# Altium schematic sheet IoT_Greenhouse V1.0 A - Pwr Input.SchDoc
size A4; SheetNumber: 2; SheetTotal: 5
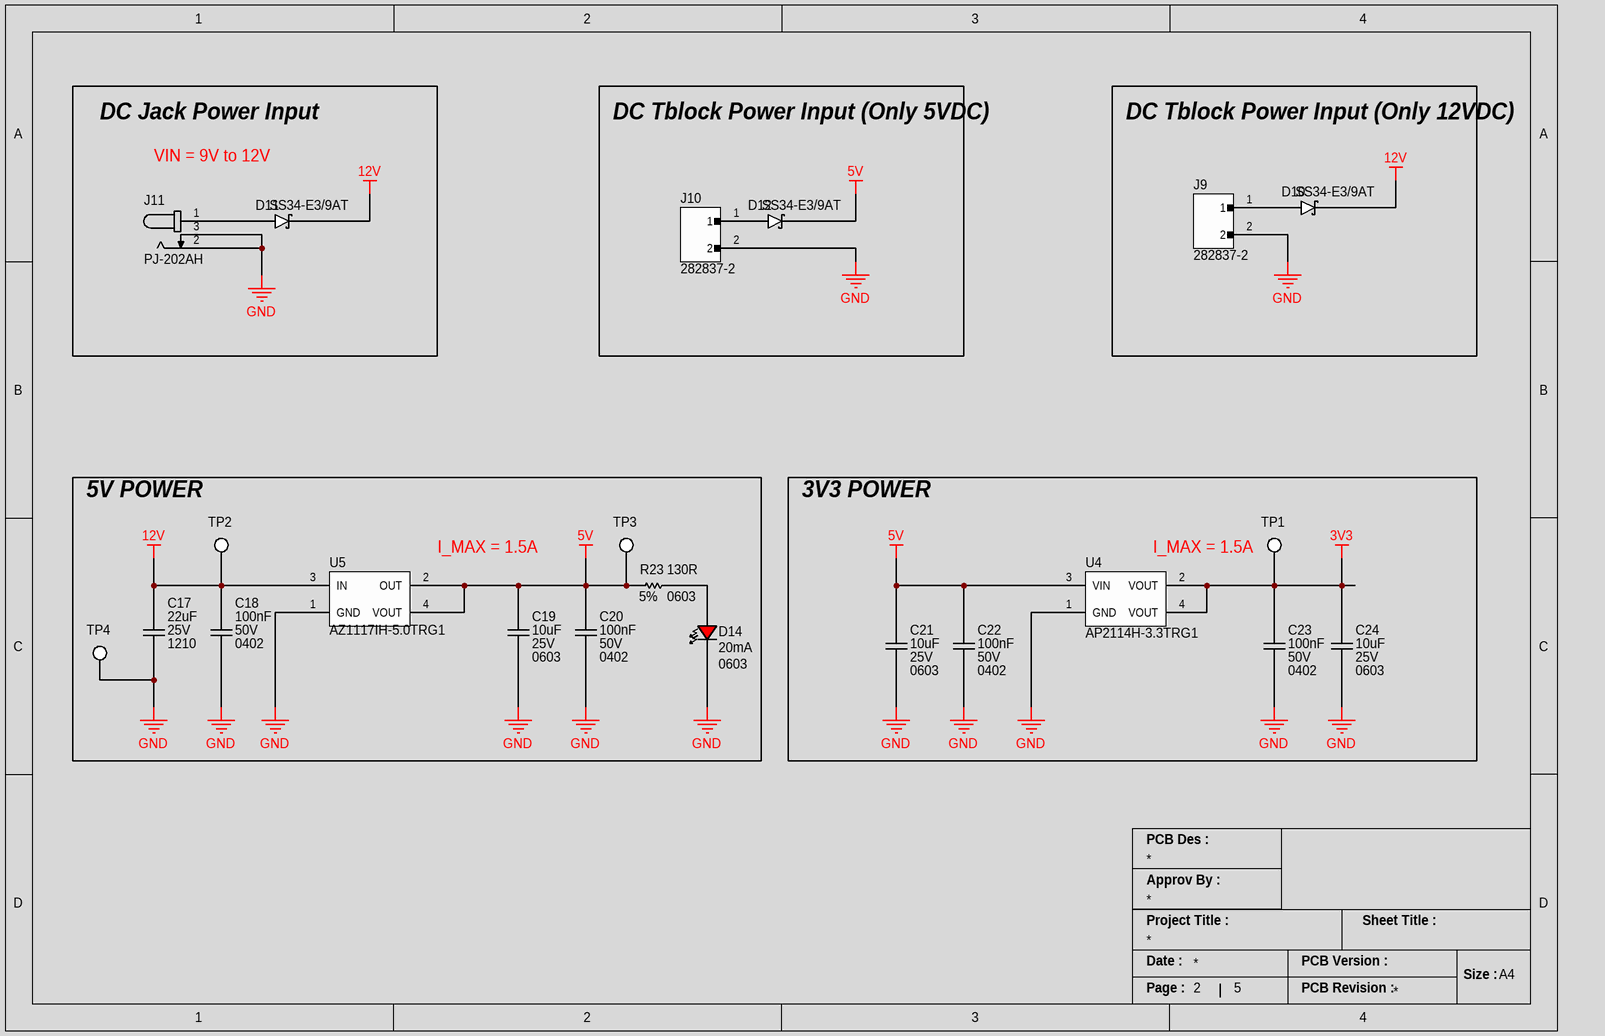
[diagram p0: IoT_Greenhouse V1.0 A - Pwr Input.SchDoc]

## Parts
C17  Voltage Rating: 25V  Capacitance: 22uF  Case/Package: 1210  [CAP_1210_CAPC3225X270N]  (hidden comment: GRM32ER71E226KE15L)
C18  Voltage Rating: 50V  Capacitance: 100nF  Case/Package: 0402  [CAP_0402_CAPC1005X05N]  (hidden comment: GRM155R71H104KE14D)
C19  Case/Package: 0603  Capacitance: 10uF  Voltage Rating: 25V  [CAP_0603_CAPC1608X08N]  (hidden comment: GRM188R61E106MA73D)
C20  Voltage Rating: 50V  Capacitance: 100nF  Case/Package: 0402  [CAP_0402_CAPC1005X05N]  (hidden comment: GRM155R71H104KE14D)
C21  Case/Package: 0603  Capacitance: 10uF  Voltage Rating: 25V  [CAP_0603_CAPC1608X08N]  (hidden comment: GRM188R61E106MA73D)
C22  Voltage Rating: 50V  Capacitance: 100nF  Case/Package: 0402  [CAP_0402_CAPC1005X05N]  (hidden comment: GRM155R71H104KE14D)
C23  Voltage Rating: 50V  Capacitance: 100nF  Case/Package: 0402  [CAP_0402_CAPC1005X05N]  (hidden comment: GRM155R71H104KE14D)
C24  Case/Package: 0603  Capacitance: 10uF  Voltage Rating: 25V  [CAP_0603_CAPC1608X08N]  (hidden comment: GRM188R61E106MA73D)
D10  SS34-E3/9AT  [DIO_Vishay_SMC_MFG]
D11  SS34-E3/9AT  [DIO_Vishay_SMC_MFG]
D12  SS34-E3/9AT  [DIO_Vishay_SMC_MFG]
D14  Test Current: 20mA  Case/Package: 0603  [LED_0603-RED-0.75mm]  (hidden comment: LTST-C190KRKT)
J9  282837-2  [CONN_TBLOCK_2P_\2828372]
J10  282837-2  [CONN_TBLOCK_2P_\2828372]
J11  PJ-202AH  [CONN_CUI_PJ-202AH]
R23  Tolerance: 5%  Resistence: 130R  Case/packcage: 0603  [RES_0603_RESC1608X04N]  (hidden comment: RC0603JR-07130RL)
TP1  NO COMPONENT  [TP_PAD_1.6MM_SMD_ROUND]  (value not drawn)  (no BOM)
TP2  NO COMPONENT  [TP_PAD_1.6MM_SMD_ROUND]  (value not drawn)  (no BOM)
TP3  NO COMPONENT  [TP_PAD_1.6MM_SMD_ROUND]  (value not drawn)  (no BOM)
TP4  NO COMPONENT  [TP_PAD_1.6MM_SMD_ROUND]  (value not drawn)  (no BOM)
U4  AP2114H-3.3TRG1  [IC_REG_SOT230P700X180-4N]
U5  AZ1117IH-5.0TRG1  [IC_REG_SOT230P700X180-4N]

## Blocks framed on the sheet
DC Jack Power Input: D11 J11
DC Tblock Power Input (Only 5VDC): D12 J10
DC Tblock Power Input (Only 12VDC): D10 J9
5V POWER: C17-C20 D14 R23 TP2-TP4 U5
3V3 POWER: C21-C24 TP1 U4

## Nets
3V3: C23.2 C24.2 TP1.1 U4.2(VOUT) U4.4(VOUT)
5V: C19.2 C20.2 C21.2 C22.2 D12.1(K) R23.1 TP3.1 U4.3(VIN) U5.2(OUT) U5.4(VOUT)
12V: C17.2 C18.2 D10.1(K) D11.1(K) TP2.1 U5.3(IN)
GND: C17.1 C18.1 C19.1 C20.1 C21.1 C22.1 C23.1 C24.1 D14.1(C) J9.2 J10.2 J11.2 J11.3 TP4.1 U4.1(GND) U5.1(GND)
NetD10_2: D10.2(A) J9.1
NetD11_2: D11.2(A) J11.1
NetD12_2: D12.2(A) J10.1
NetD14_2: D14.2(A) R23.2

## Notes on the sheet
- VIN = 9V to 12V
- (near U5) I_MAX = 1.5A
- (near TP1) I_MAX = 1.5A
- PCB Des :
- Approv By :
- Project Title :
- Sheet Title :
- Date :
- PCB Version :
- Size :
- A4
- Page :
- PCB Revision :

## Library data of the parts
C17 = CAP_22UF_25V_X7R_1210: Multilayer Ceramic Capacitor, 22 uF, 25 V, ± 10%, X7R, 1210 [3225 Metric]; Manufacturer: Murata; Color: 46Colour; Current Rating: 3A; Gender: 29Gender; Supplier 1: Digikey; Manufacturer Part Number: GRM32ER71E226KE15L; RoHS: Yes; Category: Ceramic Capacitors; Stock 1: 230605; Pricing 1: 1=0.76, 10=0.535, 50=0.4502, 100=0.3666, 500=0.30548 (USD); Mount: Surface Mount; Number of Pins: 2; Case Code (Metric): 3225; Case Code (Imperial): 1210; Material: Ceramic; Contact Material: 150ConductorMaterial; Contact Plating: 157ConductorMaterial; Min Operating Temperature: -55°C; Max Operating Temperature: 125°C; Tolerance: 10%; Dielectric: X7R; Packaging: Tape and Reel; Package Quantity: 1; Voltage Rating (DC): 25V; Termination: SMD/SMT; Voltage: 25V; Series: GRM; Construction: Flat; Length: 3.2mm; Width: 0.098inch; Height: 2.5mm; Thickness: 0.106inch; Depth: 2.5mm; Lead Pitch: 2.54mm; Radiation Hardening: No; Reach SVHC Compliant: No; Lead Free: Lead Free; RoHS Compliant: Yes; ComponentLink1URL: https://datasheet.ciiva.com/6072/1697714-6072768.pdf?src-supplier=Farnell; ComponentLink1Description: https://datasheet.ciiva.com/6072/1697714-6072768.pdf?src-supplier=Farnell; ComponentLink2URL: https://datasheet.ciiva.com/3776/2741grm32er71e226ke1523-3776996.pdf?src-supplier=Arrow+Electronics; ComponentLink2Description: https://datasheet.ciiva.com/3776/2741grm32er71e226ke1523-3776996.pdf?src-supplier=Arrow+Electronics; ComponentLink3URL: https://datasheet.ciiva.com/11789/0900766b80ef921d-11789129.pdf?src-supplier=Rs; ComponentLink3Description: https://datasheet.ciiva.com/11789/0900766b80ef921d-11789129.pdf?src-supplier=Rs; ComponentLink4URL: https://datasheet.ciiva.com/16497/product-16497009.pdf?src-supplier=Future+Electronics; ComponentLink4Description: https://datasheet.ciiva.com/16497/product-16497009.pdf?src-supplier=Future+Electronics; ComponentLink5URL: https://datasheet.ciiva.com/29201/451826-da-01-de-vs-kondens-grm32-er71e-226ke15l-29201795.pdf?src-supplier=Conrad; ComponentLink5Description: https://datasheet.ciiva.com/29201/451826-da-01-de-vs-kondens-grm32-er71e-226ke15l-29201795.pdf?src-supplier=Conrad; ComponentLink6URL: https://datasheet.ciiva.com/175/partnumbering-e-01-175746.pdf?src-supplier=Digikey; ComponentLink6Description: https://datasheet.ciiva.com/175/partnumbering-e-01-175746.pdf?src-supplier=Digikey; ComponentLink7URL: https://datasheet.ciiva.com/175/partnumbering-e-01-175747.pdf?src-supplier=Digikey; ComponentLink7Description: https://datasheet.ciiva.com/175/partnumbering-e-01-175747.pdf?src-supplier=Digikey; ComponentLink8URL: https://datasheet.ciiva.com/175/partnumbering-e-01-175748.pdf?src-supplier=Digikey; ComponentLink8Description: https://datasheet.ciiva.com/175/partnumbering-e-01-175748.pdf?src-supplier=Digikey; ComponentLink9URL: https://datasheet.ciiva.com/22703/1697714-22703397.pdf?src-supplier=Element14; ComponentLink9Description: https://datasheet.ciiva.com/22703/1697714-22703397.pdf?src-supplier=Element14; Supplier Part Number 1: 490-5313-1-ND
C18 C20 C22 C23 = CAP_100NF_50V_X7R_0402: Multilayer Ceramic Capacitor, 0.1 uF, 16 V, ± 10%, X7R, 0402 [1005 Metric]; Manufacturer: Murata; Dissipation Factor: 0.025%; Temperature Coefficient: 30ppm/°C; Supplier 1: DigiKey; Manufacturer Part Number: GRM155R71H104KE14D; RoHS: Yes; Category: Ceramic Capacitors; Stock 1: 13730790; Pricing 1: 1=0.1, 10=0.023, 50=0.0132, 100=0.0102, 500=0.00768, 1000=0.00603, 2500=0.00548, 5000=0.00504 (USD); Mount: Surface Mount; Number of Pins: 2NUMBER; Case Code (Metric): 1005; Material: Ceramic; Case Code (Imperial): 0402; Weight: 0.000212oz; Dielectric Material: Ceramic; Min Operating Temperature: -55°C; Max Operating Temperature: 125°C; Packaging: Tape and Reel; Package Quantity: 10000; Series: GRM; Tolerance: 10%; Dielectric: X7R; Termination: SMD/SMT; Voltage: 50V; Voltage Rating (DC): 50V; Construction: Flat; Length: 1mm; Width: 0.5mm; Height: 0.5mm; Depth: 0.5mm; Thickness: 0.022inch; Reach SVHC Compliant: No; RoHS Compliant: Yes; Lead Free: 5697LeadFree; ComponentLink1URL: http://www.farnell.com/datasheets/2079156.pdf?src-supplier=Farnell; ComponentLink1Description: http://www.farnell.com/datasheets/2079156.pdf?src-supplier=Farnell; ComponentLink2URL: http://www.mouser.com/ds/2/281/c02e-2905.pdf?src-supplier=Mouser; ComponentLink2Description: http://www.mouser.com/ds/2/281/c02e-2905.pdf?src-supplier=Mouser; ComponentLink3URL: http://www.farnell.com/datasheets/2079156.pdf?src-supplier=Newark; ComponentLink3Description: http://www.farnell.com/datasheets/2079156.pdf?src-supplier=Newark; ComponentLink4URL: https://datasheet.octopart.com/GRM155R71H104KE14D-Murata-datasheet-22122223.pdf?src-supplier=Future+Electronics; ComponentLink4Description: https://datasheet.octopart.com/GRM155R71H104KE14D-Murata-datasheet-22122223.pdf?src-supplier=Future+Electronics; ComponentLink5URL: https://search.murata.co.jp/Ceramy/image/img/A01X/G101/ENG/GRM155R71H104KE14-01.pdf?src-supplier=Digi-Key; ComponentLink5Description: https://search.murata.co.jp/Ceramy/image/img/A01X/G101/ENG/GRM155R71H104KE14-01.pdf?src-supplier=Digi-Key; ComponentLink6URL: http://psearch.en.murata.com/capacitor/product/GRM155R71H104KE14%23.pdf?src-supplier=Avnet; ComponentLink6Description: http://psearch.en.murata.com/capacitor/product/GRM155R71H104KE14%23.pdf?src-supplier=Avnet; ComponentLink7URL: https://datasheet.octopart.com/GRM155R71H104KE14D-Murata-datasheet-66077078.pdf?src-supplier=Element14; ComponentLink7Description: https://datasheet.octopart.com/GRM155R71H104KE14D-Murata-datasheet-66077078.pdf?src-supplier=Element14; Supplier Part Number 1: 490-10700-6-ND; Supplier 2: Digikey; Stock 2: 3706055; Pricing 2: 1=0.1, 10=0.037, 50=0.021, 100=0.0162, 500=0.01224, 1000=0.00961, 2500=0.00874, 5000=0.00804 (USD); Halogen Free: 5694HalogenFree; ComponentLink8URL: http://www.mouser.com/ds/2/447/UPY-GPHC_X5R_4V-to-50V_25-1131599.pdf?src-supplier=Mouser; ComponentLink8Description: http://www.mouser.com/ds/2/447/UPY-GPHC_X5R_4V-to-50V_25-1131599.pdf?src-supplier=Mouser; ComponentLink9URL: https://datasheet.octopart.com/CC0402KRX5R8BB104-Yageo-datasheet-137700082.pdf?src-supplier=Future+Electronics; ComponentLink9Description: https://datasheet.octopart.com/CC0402KRX5R8BB104-Yageo-datasheet-137700082.pdf?src-supplier=Future+Electronics; ComponentLink10URL: http://www.yageo.com/documents/recent/UPY-GPHC_X5R_4V-to-50V_25.pdf?src-supplier=Digikey; ComponentLink10Description: http://www.yageo.com/documents/recent/UPY-GPHC_X5R_4V-to-50V_25.pdf?src-supplier=Digikey; ComponentLink11URL: https://datasheet.octopart.com/CC0402KRX5R8BB104-Yageo-datasheet-140260304.pdf?src-supplier=Newark; ComponentLink11Description: https://datasheet.octopart.com/CC0402KRX5R8BB104-Yageo-datasheet-140260304.pdf?src-supplier=Newark; ComponentLink12URL: https://datasheet.octopart.com/CC0402KRX5R8BB104-Yageo-datasheet-170350636.pdf?src-supplier=Future+Electronics; ComponentLink12Description: https://datasheet.octopart.com/CC0402KRX5R8BB104-Yageo-datasheet-170350636.pdf?src-supplier=Future+Electronics; ComponentLink13URL: http://www.yageo.com/documents/recent/UPY-GPHC_X5R_4V-to-50V-16.pdf?src-supplier=Future+Electronics; ComponentLink13Description: http://www.yageo.com/documents/recent/UPY-GPHC_X5R_4V-to-50V-16.pdf?src-supplier=Future+Electronics; Supplier Part Number 2: 311-1697-1-ND
C19 C21 C24 = CAP_10UF_25V_X5R_0603: Multilayer Ceramic Capacitor, 10 uF, 25 V, ± 20%, X5R, 0603 [1608 Metric]; Manufacturer: Murata; Material: 4241ConductorMaterial; Supplier 1: Digi-Key; Manufacturer Part Number: GRM188R61E106MA73D; RoHS: Yes; Category: Ceramic Capacitors; Stock 1: 2712970; Pricing 1: 1=0.26, 10=0.168, 50=0.1176, 100=0.0949, 500=0.07054, 1000=0.06173 (USD); Mount: Surface Mount; Number of Pins: 2; Case Code (Imperial): 0603; Weight: 0.000222oz; Min Operating Temperature: -55°C; Max Operating Temperature: 85°C; Tolerance: 20%; Packaging: Cut Tape; Package Quantity: 1; Dielectric: X5R; Voltage: 25V; Termination: SMD/SMT; Voltage Rating (DC): 25V; Series: GRM; Construction: Flat; Length: 1.6mm; Width: 0.031inch; Height: 0.8mm; Thickness: 0.031inch; Depth: 0.8mm; Reach SVHC Compliant: No; Lead Free: Lead Free; RoHS Compliant: Yes; ComponentLink1URL: https://datasheet.ciiva.com/22776/c02e-22776427.pdf?src-supplier=Farnell; ComponentLink1Description: https://datasheet.ciiva.com/22776/c02e-22776427.pdf?src-supplier=Farnell; ComponentLink2URL: https://datasheet.ciiva.com/22619/c02e-22619674.pdf?src-supplier=Element14; ComponentLink2Description: https://datasheet.ciiva.com/22619/c02e-22619674.pdf?src-supplier=Element14; ComponentLink3URL: https://datasheet.ciiva.com/22776/608985-22776426.pdf?src-supplier=Farnell; ComponentLink3Description: https://datasheet.ciiva.com/22776/608985-22776426.pdf?src-supplier=Farnell; ComponentLink4URL: https://datasheet.ciiva.com/14906/partnumbering-e-01-14906431.pdf?src-supplier=Digi-Key; ComponentLink4Description: https://datasheet.ciiva.com/14906/partnumbering-e-01-14906431.pdf?src-supplier=Digi-Key; ComponentLink5URL: https://datasheet.ciiva.com/14906/partnumbering-e-01-14906429.pdf?src-supplier=Digi-Key; ComponentLink5Description: https://datasheet.ciiva.com/14906/partnumbering-e-01-14906429.pdf?src-supplier=Digi-Key; Supplier Part Number 1: 490-7202-1-ND; Case Code (Metric): 1608
D10-D12 = DIO_SCTKY_40V_3A: Rectifier Diode, schottky, 40V V(Rrm), do-214Ab / Smc; Manufacturer: Vishay Semiconductors; Max Surge Current: 100A; Element Configuration: Single; Max Reverse Leakage Current: 500uA; Average Rectified Current: 3A; Forward Voltage: 500mV; Supplier 1: TTI; Manufacturer Part Number: SS34-E3/9AT; RoHS: Yes; Category: Rectifier Diodes; Stock 1: 7000; Pricing 1: 3500=0.18200 (USD); Mount: Surface Mount; Case/Package: SMC; Number of Pins: 2; Min Operating Temperature: -55°C; Max Operating Temperature: 125°C; Package Quantity: 3500; Packaging: Tape and Reel; Peak Non-Repetitive Surge Current: 100A; Max Reverse Voltage (DC): 40V; Series: -; Radiation Hardening: No; RoHS Compliant: Yes; ComponentLink1URL: https://datasheet.ciiva.com/920/ss32-920172.pdf?src-supplier=Digi-Key; ComponentLink1Description: https://datasheet.ciiva.com/920/ss32-920172.pdf?src-supplier=Digi-Key; Supplier Part Number 1: SS34-E3/9AT; Max Reverse Current: 500uA; Max Repetitive Reverse Voltage (Vrrm): 40V; Forward Current: 3A
D14 = LED_DIO_RED_20mA_0603: LED,  LTST-C190KRKT; Manufacturer: Vishay Lite-On; Color: Red; Lens Color: Colorless; Luminous Intensity: 54mcd; Viewing Angle: 130°; Lens Style: Diffused,Colorless,Clear,Rectangular; Power Rating: 75mW; Dominant Wavelength: 631nm; Lens Transparency: Clear; Number of Elements: 1; Wavelength: 639nm; Reverse Voltage: 5V; Forward Current: 30mA; Forward Voltage: 2.4V; Manufacturer Part Number: LTST-C190KRKT; RoHS: Yes; Category: LEDs; Stock 1: 712361; Pricing 1: 1=0.24000, 10=0.13200, 100=0.06110, 500=0.05640, 1000=0.04418, 2000=0.04324 (USD); Mount: Surface Mount; Number of Pins: 2; Case Code (Metric): 1608; Case Code (Imperial): 0603; Min Operating Temperature: -55°C; Max Operating Temperature: 85°C; Packaging: Tape and Reel; Package Quantity: 1; Illumination Color: Red; Power Dissipation: 75mW; Number of LEDs: 1; Length: 1.6mm; Width: 0.8mm; Height: 0.8mm; Depth: 0.8mm; Radiation Hardening: No; Lead Free: Lead Free; RoHS Compliant: Yes; ComponentLink1URL: https://datasheet.ciiva.com/19482/1260381-19482354.pdf?src-supplier=Jameco; ComponentLink1Description: https://datasheet.ciiva.com/19482/1260381-19482354.pdf?src-supplier=Jameco; ComponentLink2URL: https://datasheet.ciiva.com/12403/100-ltst-c190krkt-59805-12403895.pdf?src-supplier=Mouser; ComponentLink2Description: https://datasheet.ciiva.com/12403/100-ltst-c190krkt-59805-12403895.pdf?src-supplier=Mouser; ComponentLink3URL: https://datasheet.ciiva.com/16427/ltst-c190krkt-16427674.pdf?src-supplier=Future+Electronics; ComponentLink3Description: https://datasheet.ciiva.com/16427/ltst-c190krkt-16427674.pdf?src-supplier=Future+Electronics; ComponentLink4URL: https://datasheet.ciiva.com/15117/getdatasheetpartid-57395-15117240.pdf?src-supplier=Verical; ComponentLink4Description: https://datasheet.ciiva.com/15117/getdatasheetpartid-57395-15117240.pdf?src-supplier=Verical; ComponentLink5URL: https://datasheet.ciiva.com/11774/0900766b80dc02a9-11774043.pdf?src-supplier=Rs; ComponentLink5Description: https://datasheet.ciiva.com/11774/0900766b80dc02a9-11774043.pdf?src-supplier=Rs; ComponentLink6URL: https://datasheet.ciiva.com/2109/s-110-ltst-c190krkt-2109992.pdf?src-supplier=Digi-Key; ComponentLink6Description: https://datasheet.ciiva.com/2109/s-110-ltst-c190krkt-2109992.pdf?src-supplier=Digi-Key; ComponentLink7URL: https://datasheet.ciiva.com/2109/s-110-ltst-c190krkt-2109991.pdf?src-supplier=Digi-Key; ComponentLink7Description: https://datasheet.ciiva.com/2109/s-110-ltst-c190krkt-2109991.pdf?src-supplier=Digi-Key; ComponentLink8URL: https://datasheet.ciiva.com/2109/s-110-ltst-c190krkt-2109993.pdf?src-supplier=Digi-Key; ComponentLink8Description: https://datasheet.ciiva.com/2109/s-110-ltst-c190krkt-2109993.pdf?src-supplier=Digi-Key; ComponentLink9URL: https://datasheet.ciiva.com/26937/getdatasheetpartid-631582-26937958.pdf?src-supplier=Verical; ComponentLink9Description: https://datasheet.ciiva.com/26937/getdatasheetpartid-631582-26937958.pdf?src-supplier=Verical; Supplier 1: Digi-Key; Supplier 2: Mouser; Supplier 3: Arrow Electronics; Supplier Part Number 1: 160-1436-6-ND; Supplier Part Number 2: 859-LTST-C190KRKT; Supplier Part Number 3: LTST-C190KRKT
J9 J10 = CONN_TBLOCK_2P_5.08mm_282837-2: Connector, Terminal Block; Wire Receptacle; 2 Pos.; 16-30 AWG; 0.2 in. CL; Side;; Manufacturer: TE Connectivity; Plating: Brass; Number of Levels: 1; Number of Positions Per Level: 2; Current: 13.5A; Voltage: 300V; Closed End: No (Without); Interlock: Yes (With); Voltage Rating: 250V; Connector System: Wire-to-Board; Wire Gauge (Max): 28AWG; Wire Gauge (Min): 30AWG; Pitch: 5.08mm; Thread Size: M3; Tail Length: 3.5mm; Supplier 1: Digikey; Manufacturer Part Number: 282837-2; RoHS: Yes; Category: Terminal Blocks; Stock 1: 217371; Pricing 1: 1=0.7, 10=0.681, 25=0.678, 50=0.6552, 100=0.5494, 250=0.51504, 500=0.48644, 1000=0.42635, 5000=0.37199 (USD); Mount: Through Hole; Contact Material: Brass; Contact Plating: Tin; Color: Green; Housing Color: Green; Housing Material: Polyamide; Weight: 0.059966oz; Min Operating Temperature: -40°C; Max Operating Temperature: 110°C; Number of Rows: 1; Packaging: Tray; Package Quantity: 300; Termination: Screw; Number of Positions: 2; Series: Buchanan; Current Rating: 13.5A; Screw Flange: No (Without); Screwless Terminal Block: No (Without); Side Stackable: Yes (With); Max Current Rating: 13.5A; Connector Type: Receptacle; Voltage Rating (AC): 250V; Operating Supply Voltage: 300V; Flammability Rating: UL94 V-0; RoHS Compliant: Yes; ELV: Compliant; Lead Free: Lead Free; Reach SVHC Compliant: Unknown; ComponentLink1URL: https://datasheet.ciiva.com/819/eng-cs-1308389-eurostyle-terminal-blocks-0607-819104.pdf?src-supplier=Avnet; ComponentLink1Description: https://datasheet.ciiva.com/819/eng-cs-1308389-eurostyle-terminal-blocks-0607-819104.pdf?src-supplier=Avnet; ComponentLink2URL: https://datasheet.ciiva.com/11758/0900766b80e7dc97-11758677.pdf?src-supplier=Rs; ComponentLink2Description: https://datasheet.ciiva.com/11758/0900766b80e7dc97-11758677.pdf?src-supplier=Rs; ComponentLink3URL: https://datasheet.ciiva.com/16305/eng-cs-1308389-eurostyle-terminal-blocks-0607-16305248.pdf?src-supplier=Future+Electronics; ComponentLink3Description: https://datasheet.ciiva.com/16305/eng-cs-1308389-eurostyle-terminal-blocks-0607-16305248.pdf?src-supplier=Future+Electronics; ComponentLink4URL: https://datasheet.ciiva.com/19467/750688-19467564.pdf?src-supplier=Jameco; ComponentLink4Description: https://datasheet.ciiva.com/19467/750688-19467564.pdf?src-supplier=Jameco; ComponentLink5URL: https://datasheet.ciiva.com/18620/eng-cd-282837-g3-18620917.pdf?src-supplier=Digikey; ComponentLink5Description: https://datasheet.ciiva.com/18620/eng-cd-282837-g3-18620917.pdf?src-supplier=Digikey; ComponentLink6URL: https://datasheet.ciiva.com/823/eng-cd-282837-g3-823439.pdf?src-supplier=Digikey; ComponentLink6Description: https://datasheet.ciiva.com/823/eng-cd-282837-g3-823439.pdf?src-supplier=Digikey; ComponentLink7URL: https://datasheet.ciiva.com/7978/1650926-7978569.pdf?src-supplier=Element14; ComponentLink7Description: https://datasheet.ciiva.com/7978/1650926-7978569.pdf?src-supplier=Element14; ComponentLink8URL: https://datasheet.ciiva.com/14606/70086281-14606908.pdf?src-supplier=Allied+Electronics; ComponentLink8Description: https://datasheet.ciiva.com/14606/70086281-14606908.pdf?src-supplier=Allied+Electronics; ComponentLink9URL: https://datasheet.ciiva.com/30084/eng-cs-1308389-eurostyle-terminal-blocks-0607-30084269.pdf?src-supplier=Onlinecomponents.com; ComponentLink9Description: https://datasheet.ciiva.com/30084/eng-cs-1308389-eurostyle-terminal-blocks-0607-30084269.pdf?src-supplier=Onlinecomponents.com; Supplier Part Number 1: A113320-ND
J11 = CONN_DC_JACK_2X6.5mm_PJ-202AH: 2.0 x 6.5 mm, 5.0 A, Horizontal, Through Hole, Kinked Pins, Dc Power Jack Connector; Manufacturer: CUI Devices; Body Color: Black; Shielding: Unshielded; Gender: Male; Supplier 1: Digi-Key; Manufacturer Part Number: PJ-202AH; RoHS: Yes; Category: Power Connectors; Stock 1: 143167; Pricing 1: 1=0.78, 25=0.6528, 100=0.5988, 500=0.48902, 2500=0.40274, 10000=0.36162 (USD); Mount: Through Hole; Contact Plating: Silver; Contact Material: Brass; Housing Material: PBT; Min Operating Temperature: -25°C; Max Operating Temperature: 85°C; Connector Type: Jack; Termination: Kinked Pin; Series: -; Flammability Rating: UL94 V-0; ComponentLink1URL: https://datasheet.octopart.com/PJ-202AH-CUI-Devices-datasheet-137760703.pdf?src-supplier=Future+Electronics; ComponentLink1Description: https://datasheet.octopart.com/PJ-202AH-CUI-Devices-datasheet-137760703.pdf?src-supplier=Future+Electronics; ComponentLink2URL: https://datasheet.octopart.com/PJ-202AH-CUI-datasheet-54017.pdf?src-supplier=Digi-Key; ComponentLink2Description: https://datasheet.octopart.com/PJ-202AH-CUI-datasheet-54017.pdf?src-supplier=Digi-Key; ComponentLink3URL: https://datasheet.octopart.com/PJ-202AH-CUI-Devices-datasheet-141002001.pdf?src-supplier=Electro+Sonic; ComponentLink3Description: https://datasheet.octopart.com/PJ-202AH-CUI-Devices-datasheet-141002001.pdf?src-supplier=Electro+Sonic; Supplier Part Number 1: CP-202AH-ND
R23 = RES_130R_5%_100mW_0603: Res Thick Film 0603 130 Ohm 5% 1/10W ±100ppm/°C Molded SMD SMD Paper T/R; Manufacturer: Yageo; Voltage Rating (DC): 50V; Power Rating: 100mW; Working Voltage: 75V; Manufacturer Part Number: RC0603JR-07130RL; RoHS: Yes; Category: Chip SMD Resistors; Stock 1: 487963; Pricing 1: 1=0.10000, 10=0.01600, 100=0.00640, 1000=0.00286, 2500=0.00248 (USD); Contact Plating: Tin,Matte; Case Code (Metric): 1608; Case Code (Imperial): 0603; Min Operating Temperature: -55°C; Max Operating Temperature: 155°C; Resistor Type: Thick Film; Temperature Coefficient: 100ppm/°C; Packaging: Tape and Reel; Package Quantity: 1; Voltage Rating: 50V; Number of Terminations: 2; Termination: SMD/SMT; Max Power Dissipation: 100mW; Features: Moisture Resistant; Series: RC; Construction: Rectangular; Length: 0.063inch; Width: 0.031inch; Height: 0.022inch; Depth: 0.8mm; Radiation Hardening: No; Lead Free: Lead Free; Military Standard: Not; RoHS Compliant: Yes; ComponentLink1URL: https://datasheet.ciiva.com/2518/pyu-r-int-thick-7-2518866.pdf?src-supplier=Digi-Key; ComponentLink1Description: https://datasheet.ciiva.com/2518/pyu-r-int-thick-7-2518866.pdf?src-supplier=Digi-Key; ComponentLink2URL: https://datasheet.ciiva.com/2518/pyu-r-int-thick-7-2518865.pdf?src-supplier=Digi-Key; ComponentLink2Description: https://datasheet.ciiva.com/2518/pyu-r-int-thick-7-2518865.pdf?src-supplier=Digi-Key; ComponentLink3URL: https://datasheet.ciiva.com/8887/pyu-rc0603-51-rohs-l-4-8887501.pdf?src-supplier=Avnet; ComponentLink3Description: https://datasheet.ciiva.com/8887/pyu-rc0603-51-rohs-l-4-8887501.pdf?src-supplier=Avnet; Supplier 1: Digi-Key; Supplier 2: Mouser; Supplier 3: Avnet; Supplier Part Number 1: 311-130GRCT-ND; Supplier Part Number 2: 603-RC0603JR-07130RL; Supplier Part Number 3: RC0603JR-07130RL
TP1-TP4 = TP_PAD_SMD_Round: Test Point, SMD pad, round, 1.5mm, 1.6mm, 3mm diameter
U4 = IC_REG_LDO_3.3V_1A_AP2114H-3.3TRG1: IC REG LDO 3.3V 1A SOT223; Manufacturer: Diodes; Supplier 1: Digikey; Manufacturer Part Number: AP2114H-3.3TRG1; RoHS: Yes; Category: Voltage Regulators - Linear; Stock 1: 34610; Pricing 1: 1=0.41, 10=0.332, 25=0.304, 100=0.2262, 250=0.20504, 500=0.16968, 1000=0.12726 (USD); ComponentLink1URL: https://datasheet.ciiva.com/29569/ap2114-29569881.pdf?src-supplier=Digikey; ComponentLink1Description: https://datasheet.ciiva.com/29569/ap2114-29569881.pdf?src-supplier=Digikey; ComponentLink2URL: https://datasheet.ciiva.com/29569/ap2114-29569882.pdf?src-supplier=Digikey; ComponentLink2Description: https://datasheet.ciiva.com/29569/ap2114-29569882.pdf?src-supplier=Digikey; ComponentLink3URL: https://datasheet.ciiva.com/29569/ap2114-29569883.pdf?src-supplier=Digikey; ComponentLink3Description: https://datasheet.ciiva.com/29569/ap2114-29569883.pdf?src-supplier=Digikey; Supplier Part Number 1: AP2114H-3.3TRG1DICT-ND
U5 = IC_REG_LDO_5V_1A_AZ1117IH-5.0TRG1: LDO Regulator Pos 5V 1A 3-Pin SOT-223 T/R; Manufacturer: Diodes; Output Current: 800mA; Dropout Voltage: 1.2V; Number of Regulators: 1; Supplier 1: Digi-Key; Manufacturer Part Number: AZ1117IH-5.0TRG1; RoHS: Yes; Category: Voltage Regulators - Linear; Stock 1: 138078; Pricing 1: 1=0.40000, 10=0.32100, 25=0.29360, 100=0.21840, 250=0.19796, 500=0.16384, 1000=0.12288 (USD); Mount: Surface Mount; Case/Package: TO-261-4; Min Operating Temperature: -40°C; Max Operating Temperature: 125°C; Packaging: Tape and Reel; Output Voltage: 5V; Min Current Limit: 1A; RoHS Compliant: Yes; ComponentLink1URL: https://www.diodes.com/assets/Datasheets/AZ1117I.pdf?src-supplier=Digi-Key; ComponentLink1Description: https://www.diodes.com/assets/Datasheets/AZ1117I.pdf?src-supplier=Digi-Key; Supplier Part Number 1: AZ1117IH-5.0TRG1DIDKR-ND